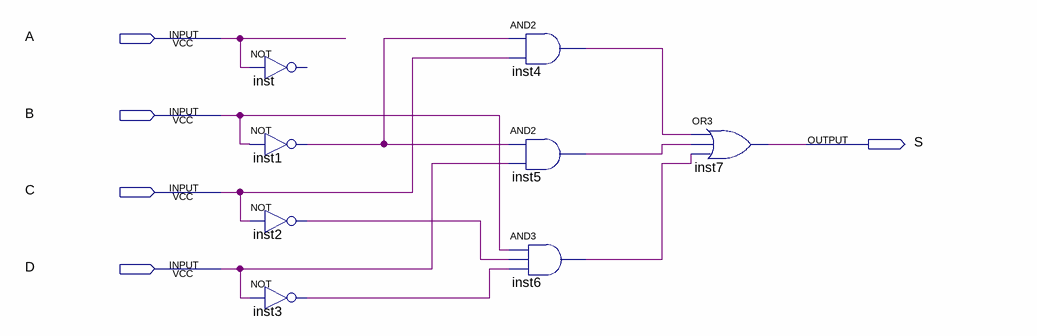
[diagram p0: schematic sheet]
// Quartus schematic testForWML.bdf as structural Verilog: 8 symbols, 5 pins
module testForWML (
  input  A,
  input  B,
  input  C,
  input  D,
  output S
);

  wire inst1_out, inst2_out, inst3_out, inst4_out, inst5_out, inst6_out;

  // NOT inst has open pins: IN=A, OUT=open
  not inst1 (inst1_out, B);
  not inst2 (inst2_out, C);
  not inst3 (inst3_out, D);
  and inst4 (inst4_out, inst1_out, C);
  and inst5 (inst5_out, inst1_out, D);
  and inst6 (inst6_out, B, inst2_out, inst3_out);
  or inst7 (S, inst4_out, inst5_out, inst6_out);
endmodule
